# EAGLE design 4-20 mA Circuit (EAGLE 9.6.2)
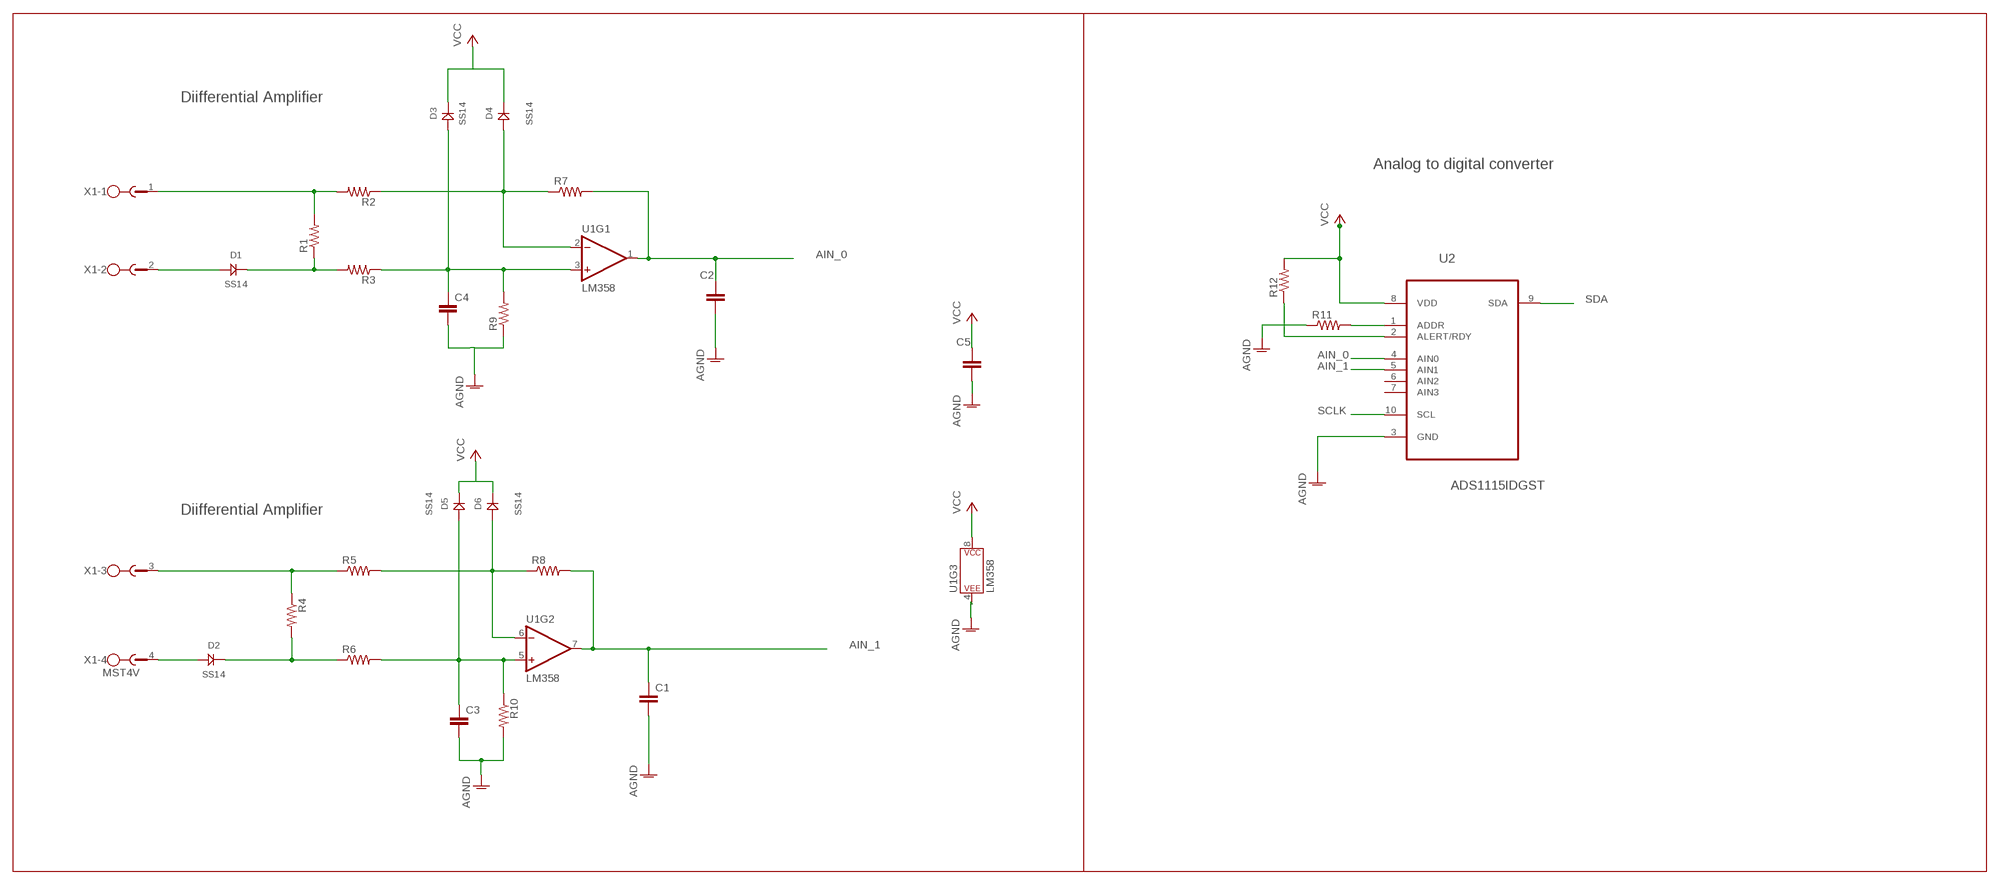
[diagram p0: schematic, sheet 1]

## Parts
C1  C-EUC0805  [C0805]
C2  C-EUC0805  [C0805]
C3  C-EUC0805  [C0805]
C4  C-EUC0805  [C0805]
C5  C-EUC0805  [C0805]
D1  SS14  [DO214]
D2  SS14  [DO214]
D3  SS14  [DO214]
D4  SS14  [DO214]
D5  SS14  [DO214]
D6  SS14  [DO214]
R1  R-US_R0805  [R0805]
R2  R-US_R0805  [R0805]
R3  R-US_R0805  [R0805]
R4  R-US_R0805  [R0805]
R5  R-US_R0805  [R0805]
R6  R-US_R0805  [R0805]
R7  R-US_R0805  [R0805]
R8  R-US_R0805  [R0805]
R9  R-US_R0805  [R0805]
R10  R-US_R0805  [R0805]
R11  R-US_R0805  [R0805]
R12  R-US_R0805  [R0805]
U1  LM358  [DIP08]
U2  ADS1115IDGST  [SOP50P490X110-10N]
X1  MST4V  [MSTBV4]

## Nets
AGND: C1.2 C2.2 C3.2 C4.2 C5.2 R9.1 R10.2 R11.1 U1.4(P$V-) U2.3(GND)
AIN_0: C2.1 R7.2 U1.1(OUT) U2.4(AIN0)
AIN_1: C1.1 R8.2 U1.7(OUT) U2.5(AIN1)
N$1: R1.2 R2.2 X1.1
N$2: D1.CATHODE(KATHODE) R1.1 R3.2
N$3: C4.1 D3.ANODE R3.1 R9.2 U1.3(+IN)
N$4: D1.ANODE X1.2
N$5: R4.1 R5.1 X1.3
N$6: D4.ANODE R2.1 R7.1 U1.2(-IN)
N$7: D2.CATHODE(KATHODE) R4.2 R6.1
N$8: D6.ANODE R5.2 R8.1 U1.6(-IN)
N$9: C3.1 D5.ANODE R6.2 R10.1 U1.5(+IN)
N$10: D2.ANODE X1.4
N$11: R12.1 U2.2(ALERT/RDY)
N$12: R11.2 U2.1(ADDR)
SCLK: U2.10(SCL)
SDA: U2.9(SDA)
VCC: C5.1 D3.CATHODE(KATHODE) D4.CATHODE(KATHODE) D5.CATHODE(KATHODE) D6.CATHODE(KATHODE) R12.2 U1.8(P$V+) U2.8(VDD)
Unconnected: U2.6(AIN2) U2.7(AIN3)

## Notes on the sheet
- Diifferential Amplifier
- Analog to digital converter
- Diifferential Amplifier

## Library data of the parts
C1-C5 = rcl:C-EU: CAPACITOR, European symbol; SPICEPREFIX: C
D1-D6 = PC_Diode_SS14:SS14; AVAILABILITY: Unavailable; DESCRIPTION: SS14 Series 500 mV 1 A 40 V Max Reverse Voltage Schottky Rectifier - DO-214AC; MF: ON Semiconductor; MP: SS14; PACKAGE: DO-214AC-214 ON Semiconductor; PRICE: None
R1-R12 = rcl:R-US_: RESISTOR, American symbol; SPICEPREFIX: R
U1 = SparkFun-IC-Amplifiers:LM358: LM358 Jellybean op-amp Datasheet <http://www.sparkfun.com/datasheets/Components/General/LM358.pdf> SparkFun Products Op-Amp (Thru-Hole) - LM358 <https://www.sparkfun.com/products/9456> (COM-09456); PROD_ID: IC-09172
U2 = PC_IC_ADS1115IDGST:ADS1115IDGST: Analog-to-Digital Converter with Internal Reference; AVAILABILITY: Unavailable; DESCRIPTION: 16-Bit ADC with Integrated MUX, PGA, Comparator, Oscillator, and Reference 10-VSSOP -40 to 125; MF: Texas Instruments; MP: ADS1115IDGST; PACKAGE: MSOP-10 Texas Instruments; PRICE: None
X1 = con-phoenix-508:MST4V: PHOENIX; OC_FARNELL: unknown; OC_NEWARK: unknown

## Board
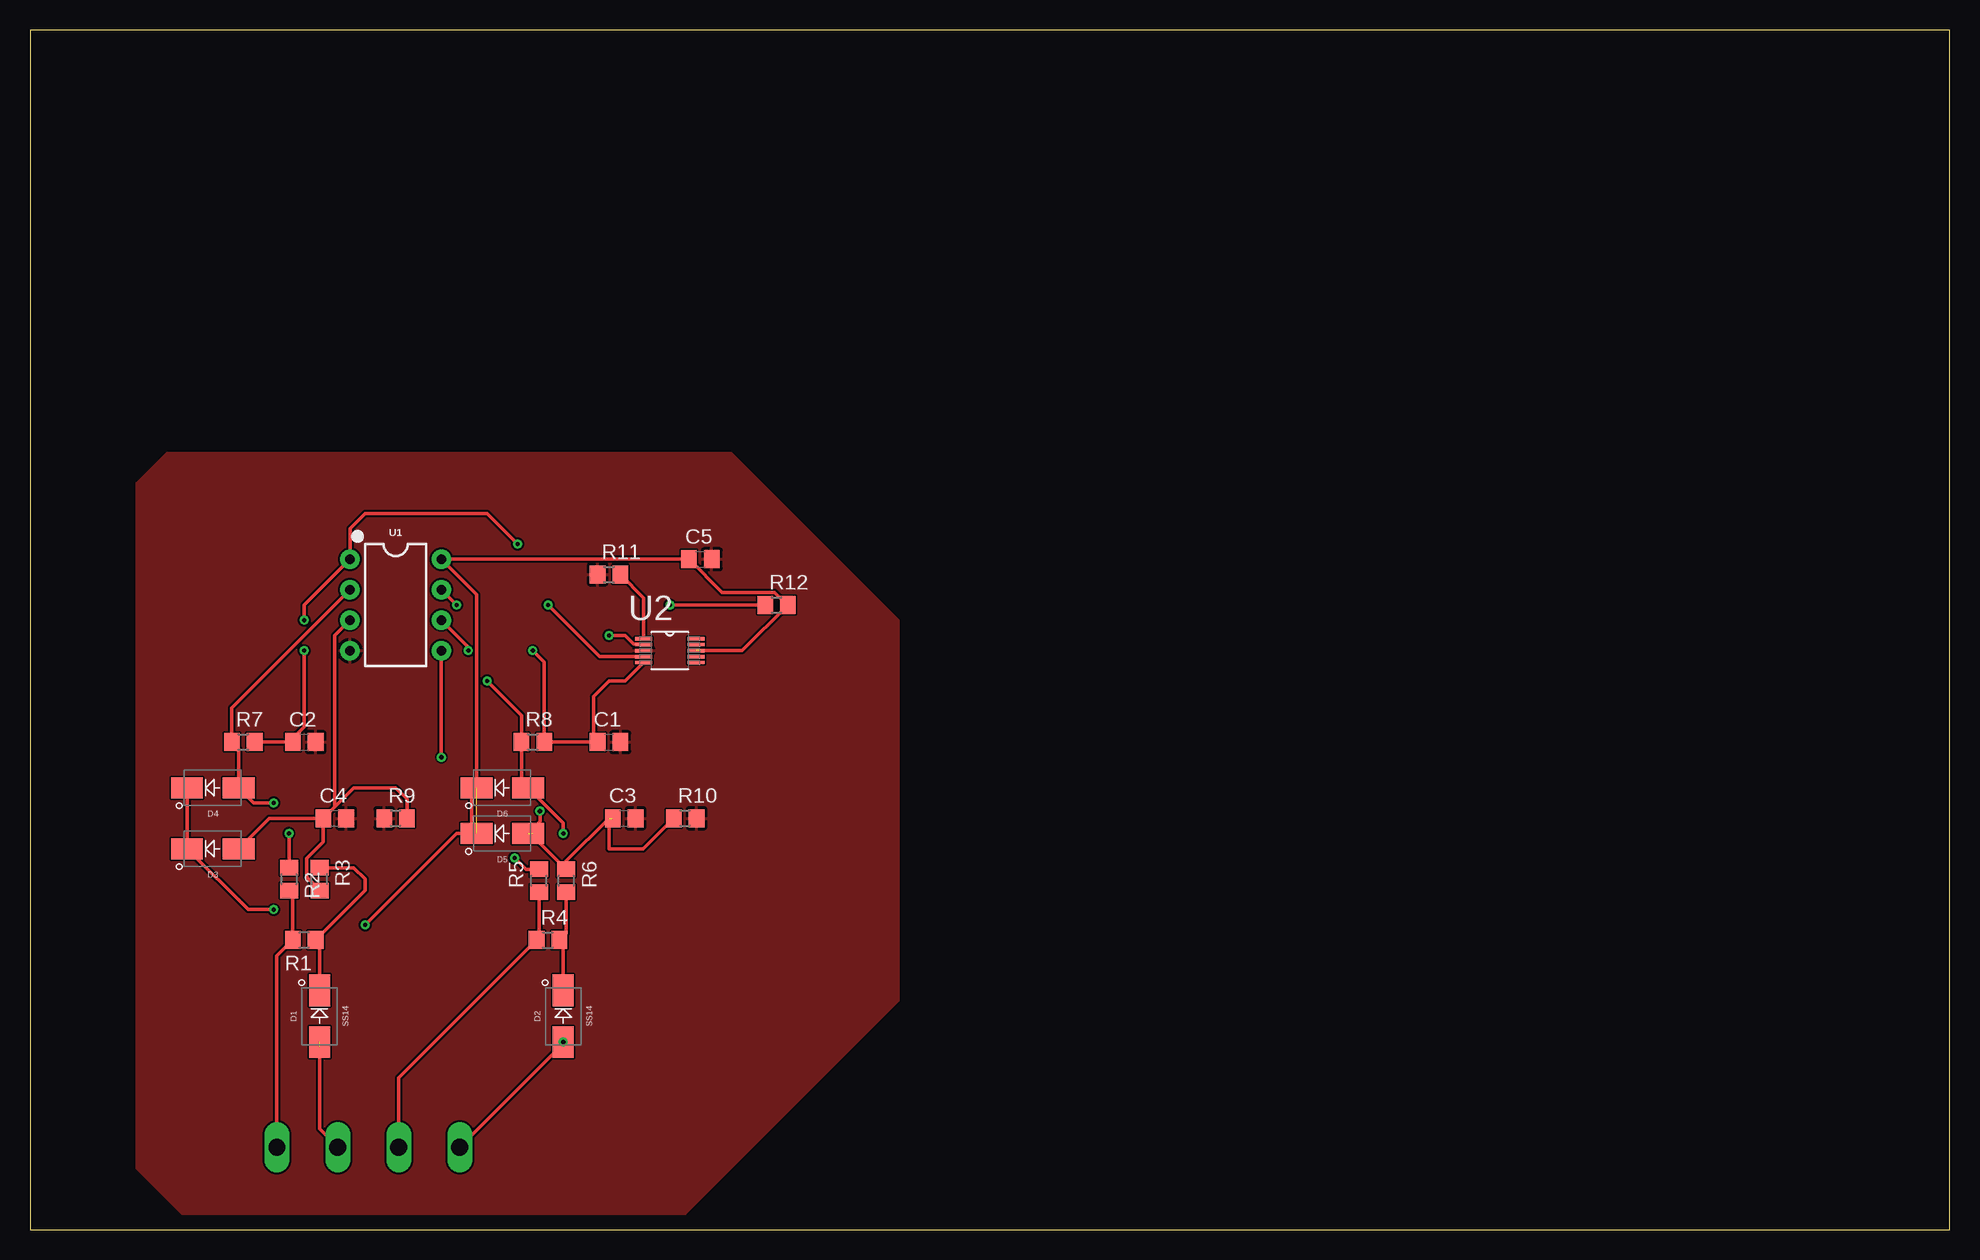
[diagram p1: board, top side]
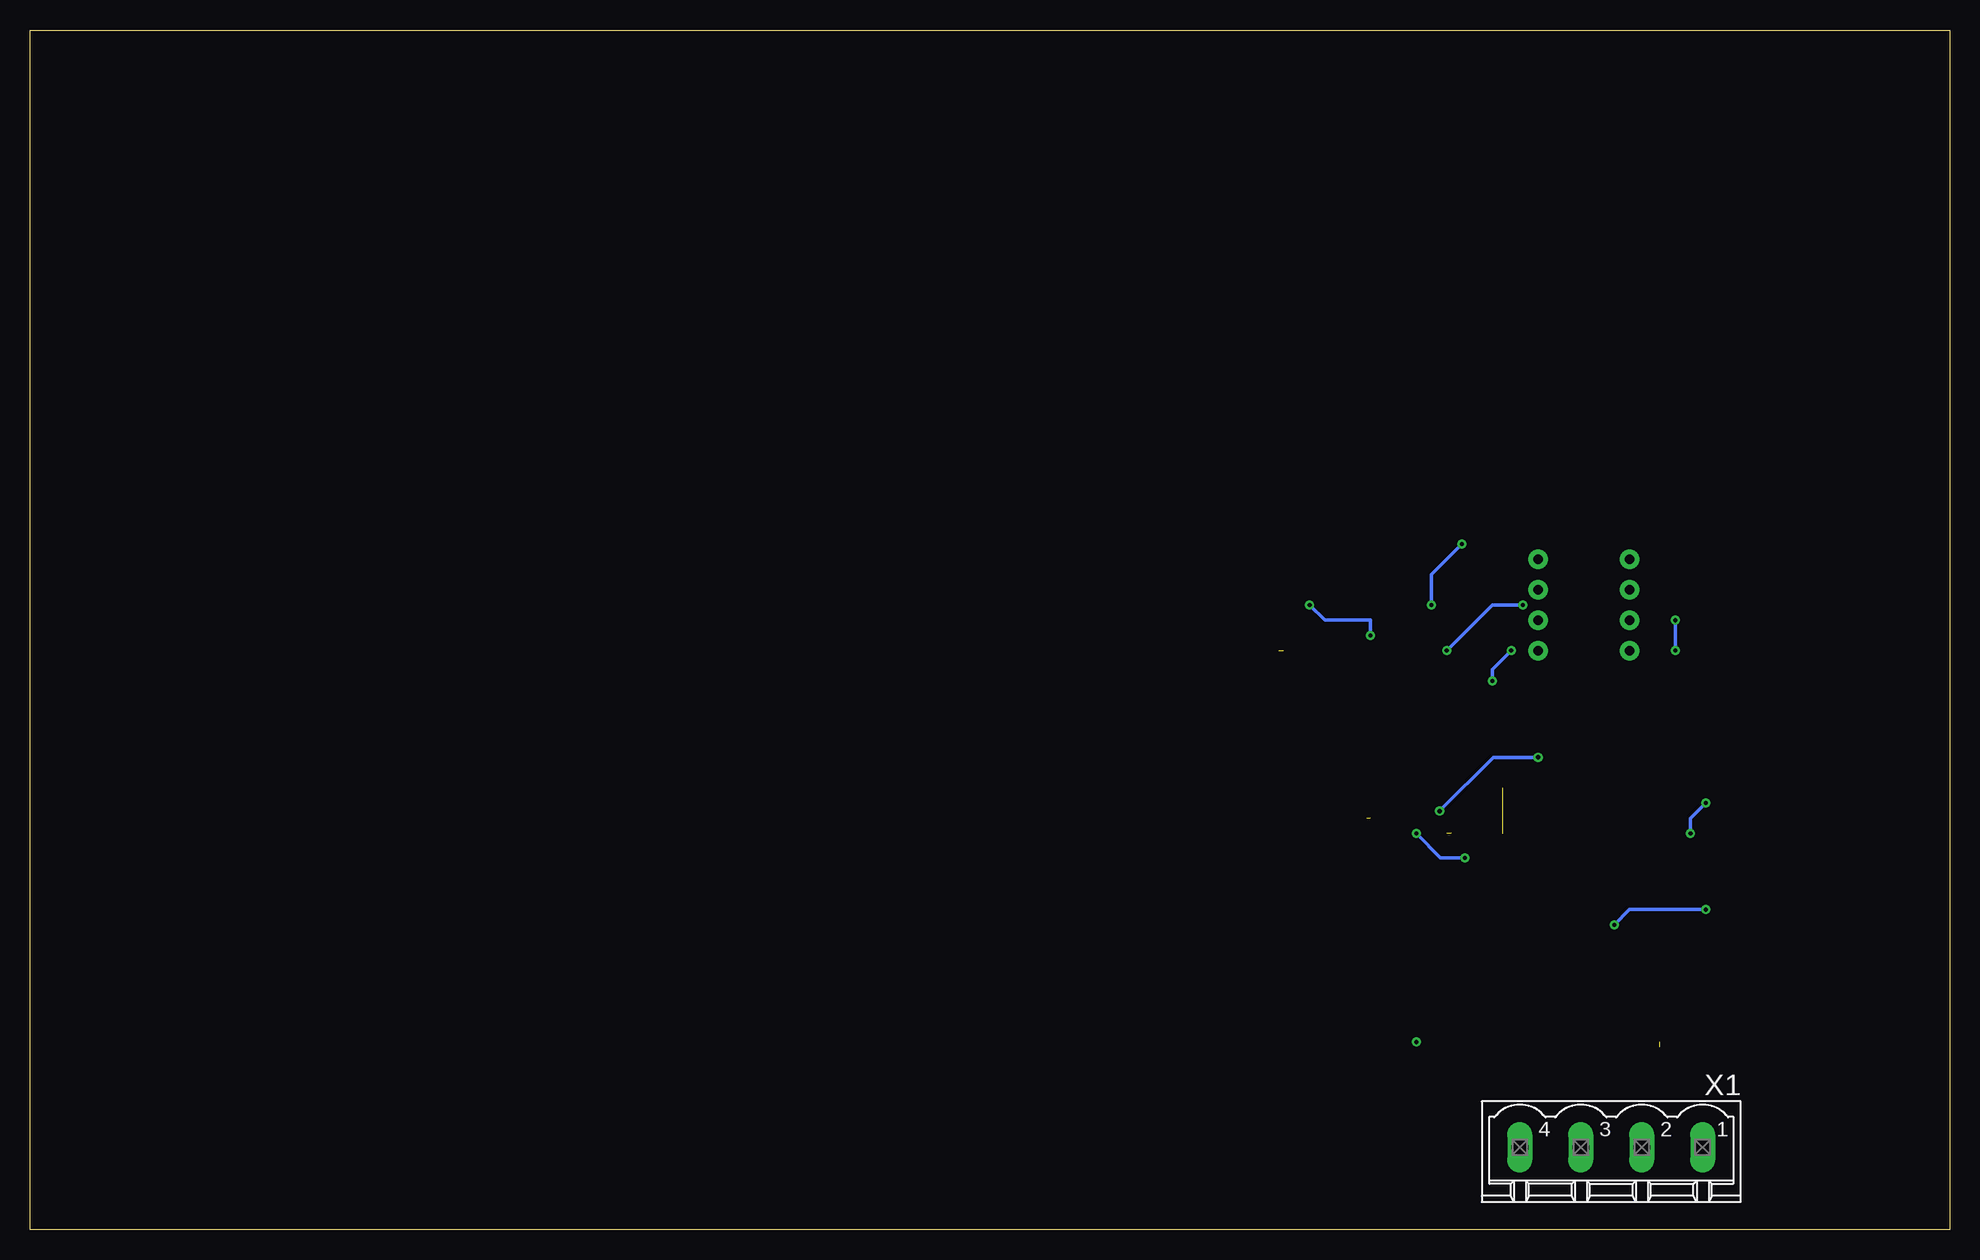
[diagram p2: board, bottom side, seen from below]

Size 160 x 100 mm. Coordinates in mm from the lower left corner, seen from the top.
Outline: 0,0 160,0 160,100 0,100 0,0
Copper layers (1*16): Top 0.035mm / dielectric 1.5mm / Bottom 0.035mm
Design rules "default": minimum track width 6mil, minimum drill 0.35mm, track to track 6mil, track to pad 6mil, pad to pad 6mil, via to via 6mil, smd to smd 6mil, copper to edge 40mil, drill to drill 6mil, minimum pad ring 10mil, minimum via ring 8mil, stop-mask expansion 4mil, vias tented up to drill 0mil, thermal gap 10mil

### Footprints (pad centres in the part's own frame; a part is rotated, then mirrored left to right if it is on the bottom)
C0805 = smd 1.3 x 1.5: 1 -0.95,0; 2 0.95,0
DO214 = smd 2.65 x 1.75: ANODE -2.15,0; CATHODE 2.15,0
R0805 = smd 1.3 x 1.5: 1 -0.95,0; 2 0.95,0
DIP08 = drill 0.813 pad 1.626: 1 -3.81,-3.81; 2 -1.27,-3.81; 3 1.27,-3.81; 4 3.81,-3.81; 5 3.81,3.81; 6 1.27,3.81; 7 -1.27,3.81; 8 -3.81,3.81
SOP50P490X110-10N = smd 1.422 x 0.279: 1 -2.184,0.991; 2 -2.184,0.508; 3 -2.184,0; 4 -2.184,-0.508; 5 -2.184,-0.991; 6 2.184,-0.991; 7 2.184,-0.508; 8 2.184,0; 9 2.184,0.508; 10 2.184,0.991
MSTBV4 = drill 1.397 long: 1 -7.62,0; 2 -2.54,0; 3 2.54,0; 4 7.62,0

### Placement (x,y rotation side)
C1  48.26,40.64 0 top
C2  22.86,40.64 0 top
C3  49.53,34.29 0 top
C4  25.4,34.29 0 top
C5  55.88,55.88 0 top
D1  24.13,17.78 90 top
D2  44.45,17.78 90 top
D3  15.24,31.75 180 top
D4  15.24,36.83 180 top
D5  39.37,33.02 180 top
D6  39.37,36.83 180 top
R1  22.86,24.13 180 top
R2  21.59,29.21 270 top
R3  24.13,29.21 90 top
R4  43.18,24.13 0 top
R5  42.42,29.08 90 top
R6  44.7,29.08 90 top
R7  17.78,40.64 0 top
R8  41.91,40.64 0 top
R9  30.48,34.29 0 top
R10  54.61,34.29 0 top
R11  48.26,54.61 0 top
R12  62.23,52.07 0 top
U1  30.48,52.07 270 top
U2  53.34,48.26 0 top
X1  28.19,6.86 180 bottom

### Tracks (layer width: path | path; a pad name or v marks a point on that pad's centre or on a via)
AGND
  pour Top: 13.97,64.77 58.42,64.77 72.39,50.8 72.39,19.05 54.61,1.27 12.7,1.27 8.89,5.08 8.89,62.23 11.43,64.77
AIN_0  (via drill 0.35)
  Top 0.305: R7.2 21.59,40.64 | 21.59,40.64 C2.1 | v22.86,50.8 22.86,52.07 U1.1 26.67,58.42 27.94,59.69 38.1,59.69 v40.64,57.15 | v22.86,48.26 22.86,41.91 21.59,40.64 | v43.18,52.07 47.5,47.75 U2.4
  Bottom 0.305: v22.86,50.8 v22.86,48.26 | v40.64,57.15 43.18,54.61 v43.18,52.07
AIN_1  (via drill 0.35)
  Top 0.305: U1.7 v35.56,52.07 | v41.91,48.26 42.86,47.31 R8.2 46.99,40.64 | 46.99,40.64 C1.1 | U2.5 49.61,45.72 48.26,45.72 46.99,44.45 46.99,40.64
  Bottom 0.305: v35.56,52.07 38.1,52.07 v41.91,48.26
N$1
  Top 0.305: X1.1 20.57,22.79 R1.2 21.91,27.94 R2.2
N$2
  Top 0.305: R3.2 26.99,30.16 27.94,29.21 27.94,28.26 R1.1 24.13,23.81 D1.CATHODE
N$3
  Top 0.305: D3.ANODE 19.93,34.29 C4.1 | C4.1 24.45,32.31 23.07,30.94 23.07,29.38 24.13,28.33 R3.1 | C4.1 26.99,36.83 30.48,36.83 31.43,35.88 R9.2 | U1.3 25.4,49.53 25.4,35.24 C4.1
N$4  (1 unrouted)
  Top 0.305: X1.2 24.13,8.38 24.13,15.24
N$5
  Top 0.305: X1.3 30.73,12.63 42.07,23.97 R4.1 42.42,24.32 R5.1
N$6  (via drill 0.35)
  Top 0.305: v20.32,35.56 18.66,35.56 D4.ANODE 17.39,40.08 R7.1 16.83,43.5 U1.2 | v21.59,33.02 R2.1
  Bottom 0.305: v20.32,35.56 21.59,34.29 v21.59,33.02
N$7
  Top 0.305: D2.CATHODE 44.45,23.81 R4.2 44.7,24.7 R6.1
N$8  (via drill 0.35)
  Top 0.305: v44.45,33.02 44.45,33.9 D6.ANODE 40.96,37.39 R8.1 40.96,42.86 v38.1,45.72 | v40.39,30.99 41.34,30.03 R5.2 | U1.6 36.54,48.55 v36.54,48.26
  Bottom 0.305: v44.45,33.02 42.42,30.99 v40.39,30.99 | v36.54,48.26 38.1,46.7 v38.1,45.72
N$9  (via drill 0.35)  (2 unrouted)
  Top 0.305: 48.26,34.29 44.7,30.73 R6.2 41.91,32.83 41.91,33.02 | R10.1 51.12,31.75 48.26,31.75 48.26,33.97 C3.1 | U1.5 v34.29,39.37 | v42.5,34.88 42.5,34 D5.ANODE
  Bottom 0.305: v34.29,39.37 38.01,39.37 v42.5,34.88
N$10  (via drill 0.35)
  Top 0.305: X1.4 44.45,15.49 D2.ANODE
  other vias: 44.45,15.63
N$11  (via drill 0.35)
  Top 0.305: R12.1 v53.34,52.07 | U2.2 51.13,48.79 50.33,48.79 49.59,49.53 v48.26,49.53
  Bottom 0.305: v53.34,52.07 52.07,50.8 48.26,50.8 v48.26,49.53
N$12
  Top 0.305: R11.2 51.16,52.66 U2.1
VCC  (via drill 0.35)  (2 unrouted)
  Top 0.305: D4.CATHODE D3.CATHODE 18.17,26.67 v20.32,26.67 | v27.94,25.4 35.56,33.02 36.83,33.02 36.83,36.44 D6.CATHODE 37.22,52.95 U1.8 C5.1 57.69,53.12 62.06,53.12 63.11,52.07 R12.2 59.37,48.26 55.88,48.26
  Bottom 0.305: v20.32,26.67 26.67,26.67 v27.94,25.4